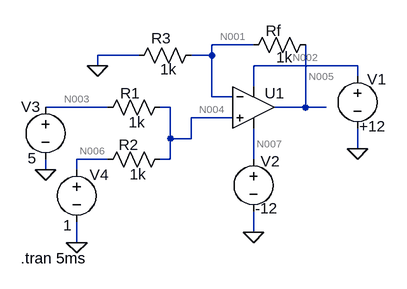
[diagram p0: schematic noninverting_adder_dc.asc]
noninverting_adder_dc.asc, the LTspice schematic file:
Version 4
SHEET 1 880 680
WIRE 208 80 144 80
WIRE 32 96 -32 96
WIRE 144 96 144 80
WIRE 144 96 112 96
WIRE -32 112 -32 96
WIRE 368 112 208 112
WIRE 368 128 368 112
WIRE 208 144 208 112
WIRE 144 160 144 96
WIRE 176 160 144 160
WIRE -16 176 -112 176
WIRE 80 176 64 176
WIRE 288 176 288 80
WIRE 288 176 240 176
WIRE 320 176 288 176
WIRE 176 192 112 192
WIRE 80 224 80 176
WIRE 112 224 112 192
WIRE 112 224 80 224
WIRE 368 240 368 208
WIRE -16 256 -64 256
WIRE 80 256 80 224
WIRE 80 256 64 256
WIRE 208 256 208 208
WIRE -112 272 -112 256
WIRE -64 272 -64 256
WIRE 208 368 208 336
WIRE -64 384 -64 352
FLAG 368 240 0
FLAG 208 368 0
FLAG -64 384 0
FLAG -112 272 0
FLAG -32 112 0
SYMBOL Opamps\\UniversalOpamp2 208 176 R0
WINDOW 0 17 -22 Left 2
SYMATTR InstName U1
SYMBOL res 80 160 R90
WINDOW 0 10 62 VBottom 2
WINDOW 3 23 51 VTop 2
SYMATTR InstName R1
SYMATTR Value 1k
SYMBOL res 80 240 R90
WINDOW 0 9 64 VBottom 2
WINDOW 3 23 50 VTop 2
SYMATTR InstName R2
SYMATTR Value 1k
SYMBOL res 304 64 R90
WINDOW 0 10 65 VBottom 2
WINDOW 3 19 48 VTop 2
SYMATTR InstName Rf
SYMATTR Value 1k
SYMBOL res 128 80 R90
WINDOW 0 5 62 VBottom 2
WINDOW 3 22 51 VTop 2
SYMATTR InstName R3
SYMATTR Value 1k
SYMBOL voltage 368 112 R0
WINDOW 0 15 21 Left 2
WINDOW 3 3 93 Left 2
SYMATTR InstName V1
SYMATTR Value +12
SYMBOL voltage 208 240 R0
WINDOW 0 11 19 Left 2
WINDOW 3 3 91 Left 2
SYMATTR InstName V2
SYMATTR Value -12
SYMBOL voltage -112 160 R0
WINDOW 0 -37 15 Left 2
WINDOW 3 -27 94 Left 2
WINDOW 123 0 0 Left 0
WINDOW 39 0 0 Left 0
SYMATTR InstName V3
SYMATTR Value 5
SYMBOL voltage -64 256 R0
WINDOW 0 20 24 Left 2
WINDOW 3 -21 101 Left 2
WINDOW 123 0 0 Left 0
WINDOW 39 0 0 Left 0
SYMATTR InstName V4
SYMATTR Value 1
TEXT -150 408 Left 2 !.tran 5ms

The netlist it stands for:
* noninverting_adder_dc.asc
XU1 N004 N001 N002 N007 N005 level.2 Avol=1Meg GBW=10Meg Slew=10Meg ilimit=25m rail=0 Vos=0 phimargin=45 en=0 enk=0 in=0 ink=0 Rin=500Meg  ; pins IN+ IN- V+ V- OUT
R1 N004 N003 1k
R2 N004 N006 1k
Rf N005 N001 1k
R3 N001 0 1k
V1 N002 0 +12
V2 N007 0 -12
V3 N003 0 5
V4 N006 0 1
.tran 5ms
.lib UniversalOpamps2.sub
.backanno
.end

* Results of the author's LTspice run, read from the files saved beside the schematic
* Operating Point, zero values left out:
*   V(n005) = 6 V
*   V(n002) = 12 V
*   V(n007) = -12 V
*   V(n001) = 3 V
*   V(n004) = 3 V
*   V(n003) = 5 V
*   V(n006) = 1 V
*   I(R3) = 3 mA
*   I(Rf) = 3 mA
*   I(R2) = 2 mA
*   I(R1) = -2 mA
*   I(V4) = 2 mA
*   I(V3) = -2 mA
*   I(V2) = 323.2 µA
*   I(V1) = -3.323 mA
*   Ix(u1:1) = 6 nA
*   Ix(u1:2) = 6 nA
*   Ix(u1:3) = 3.323 mA
*   Ix(u1:4) = -323.2 µA
*   Ix(u1:5) = -3 mA